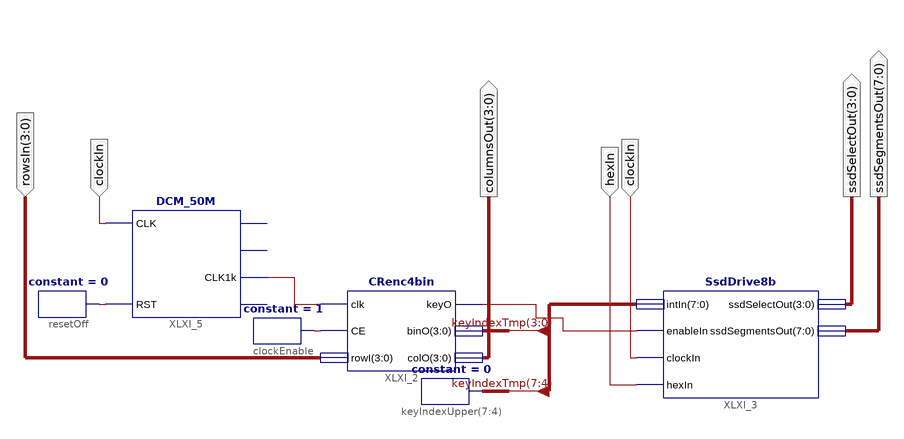
[diagram p0: schematic sheet 1]
// Xilinx ISE schematic Experiment4.sch (spartan3e) as structural Verilog: 6 symbols, 6 ports
module Experiment4 (
  input  hexIn,
  input  clockIn,
  input  [3:0] rowsIn,
  output [3:0] ssdSelectOut,
  output [7:0] ssdSegmentsOut,
  output [3:0] columnsOut
);

  wire XLXN_4, XLXN_44, XLXN_54, XLXN_103;
  wire [7:0] keyIndexTmp;

  CRenc4bin XLXI_2 (
    .clk(XLXN_103), .CE(XLXN_44), .rowI(rowsIn), .colO(columnsOut), .keyO(XLXN_4), .binO(keyIndexTmp[3:0]));
  SsdDrive8b XLXI_3 (
    .clockIn(clockIn), .intIn(keyIndexTmp), .hexIn(hexIn), .enableIn(XLXN_4), .ssdSelectOut(ssdSelectOut),
    .ssdSegmentsOut(ssdSegmentsOut));
  constant #(.CValue("0")) keyIndexUpper[7:4] (.O(keyIndexTmp[7:4]));
  constant #(.CValue("1")) clockEnable (.O(XLXN_44));
  constant #(.CValue("0")) resetOff (.O(XLXN_54));
  DCM_50M XLXI_5 (.CLK(clockIn), .RST(XLXN_54), .CLK1k(XLXN_103));  // open: CLK1M, CLK10k, CLK1
endmodule
